# Altium schematic sheet Pilot Tone - Reference.SchDoc
size Letter
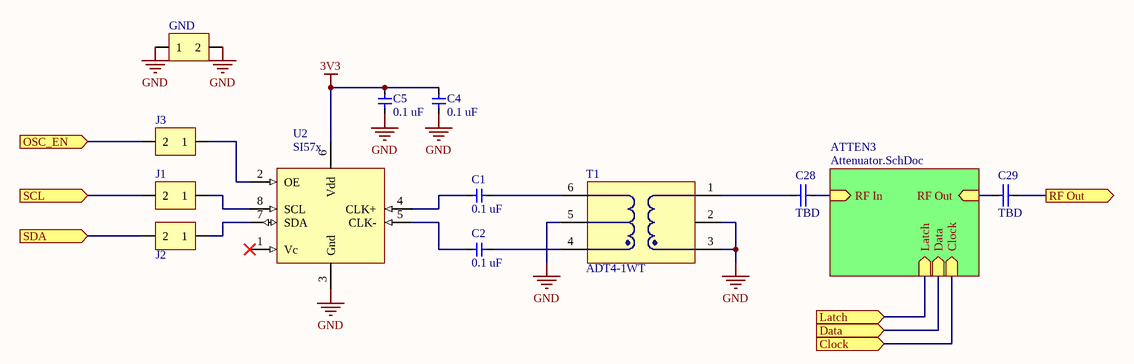
[diagram p0: Pilot Tone - Reference.SchDoc]

## Parts
C1  value 0.1 uF  [0603C]  (hidden comment: SMT Cap)
C2  value 0.1 uF  [0603C]  (hidden comment: SMT Cap)
C4  value 0.1 uF  [0603C]  (hidden comment: SMT Cap)
C5  value 0.1 uF  [0603C]  (hidden comment: SMT Cap)
C28  value TBD  [0402C]  (hidden comment: Cap)
C29  value TBD  [0402C]  (hidden comment: Cap)
GND  Jumper  [HDR1X2]  (value not drawn)
J1  Jumper  [0603R]  (value not drawn)
J2  Jumper  [0603R]  (value not drawn)
J3  Jumper  [0603R]  (value not drawn)
T1  ADT4-1WT  [CD542]
U2  SI57x  [SI57x]

## Sub-sheets
ATTEN3 = Attenuator.SchDoc: RF In (in), RF Out (in), Clock (in), Data (in), Latch (in)

## Ports
Clock (in), Data (in), Latch (in), OSC_EN (in), RF Out (out), SCL (in), SDA (in)

## Nets
3V3: C4.2 C5.2 U2.6(Vdd)
GND: C4.1 C5.1 GND.1 GND.2 T1.2(Gnd) T1.3(Coupled) T1.5(Termination) U2.3(Gnd)
Clock: port Clock, sheet ATTEN3/Clock
Data: port Data, sheet ATTEN3/Data
Latch: port Latch, sheet ATTEN3/Latch
OSC_EN: J3.2 ; port OSC_EN
RF Out: C29.2 ; port RF Out
SCL: J1.2 ; port SCL
SDA: J2.2 ; port SDA
NetC1_1: C1.1 U2.4(CLK+)
NetC1_2: C1.2 T1.6(Output)
NetC2_1: C2.1 U2.5(CLK-)
NetC2_2: C2.2 T1.4(Termination)
NetC28_1: C28.1 T1.1(Input)
NetC28_2: C28.2 ; sheet ATTEN3/RF In
NetC29_1: C29.1 ; sheet ATTEN3/RF Out
NetJ1_1: J1.1 U2.8(SCL)
NetJ2_1: J2.1 U2.7(SDA)
NetJ3_1: J3.1 U2.2(OE)

Not connected (* = marked no-connect by the designer): U2 1(Vc)*

## Library data of the parts
C1 C2 C4 C5 = Cap - SMT Small: Published: 8-Jun-2000; LatestRevisionDate: 29-May-2009; LatestRevisionNote: IPC-7351 Footprint Added.; PackageReference: C1206; Publisher: Altium Limited; PackageDescription: Chip Capacitor
C28 C29 = Cap: Capacitor; Published: 8-Jun-2000; LatestRevisionDate: 17-Jul-2002; LatestRevisionNote: Re-released for DXP Platform.; PackageReference: RAD-0.3; Publisher: Altium Limited
GND J1-J3 = Jumper - 2 Pin: Jumper - 2-Pin; LatestRevisionDate: 17-Jul-2002; LatestRevisionNote: Re-released for DXP Platform.; Publisher: Altium Limited
T1 = ADT4-1WT: Surface Mount RF Transformer
U2 = SI570: 10 MHZ TO 1.4 GHZ I2C PROGRAMMABLE XO/VCXO